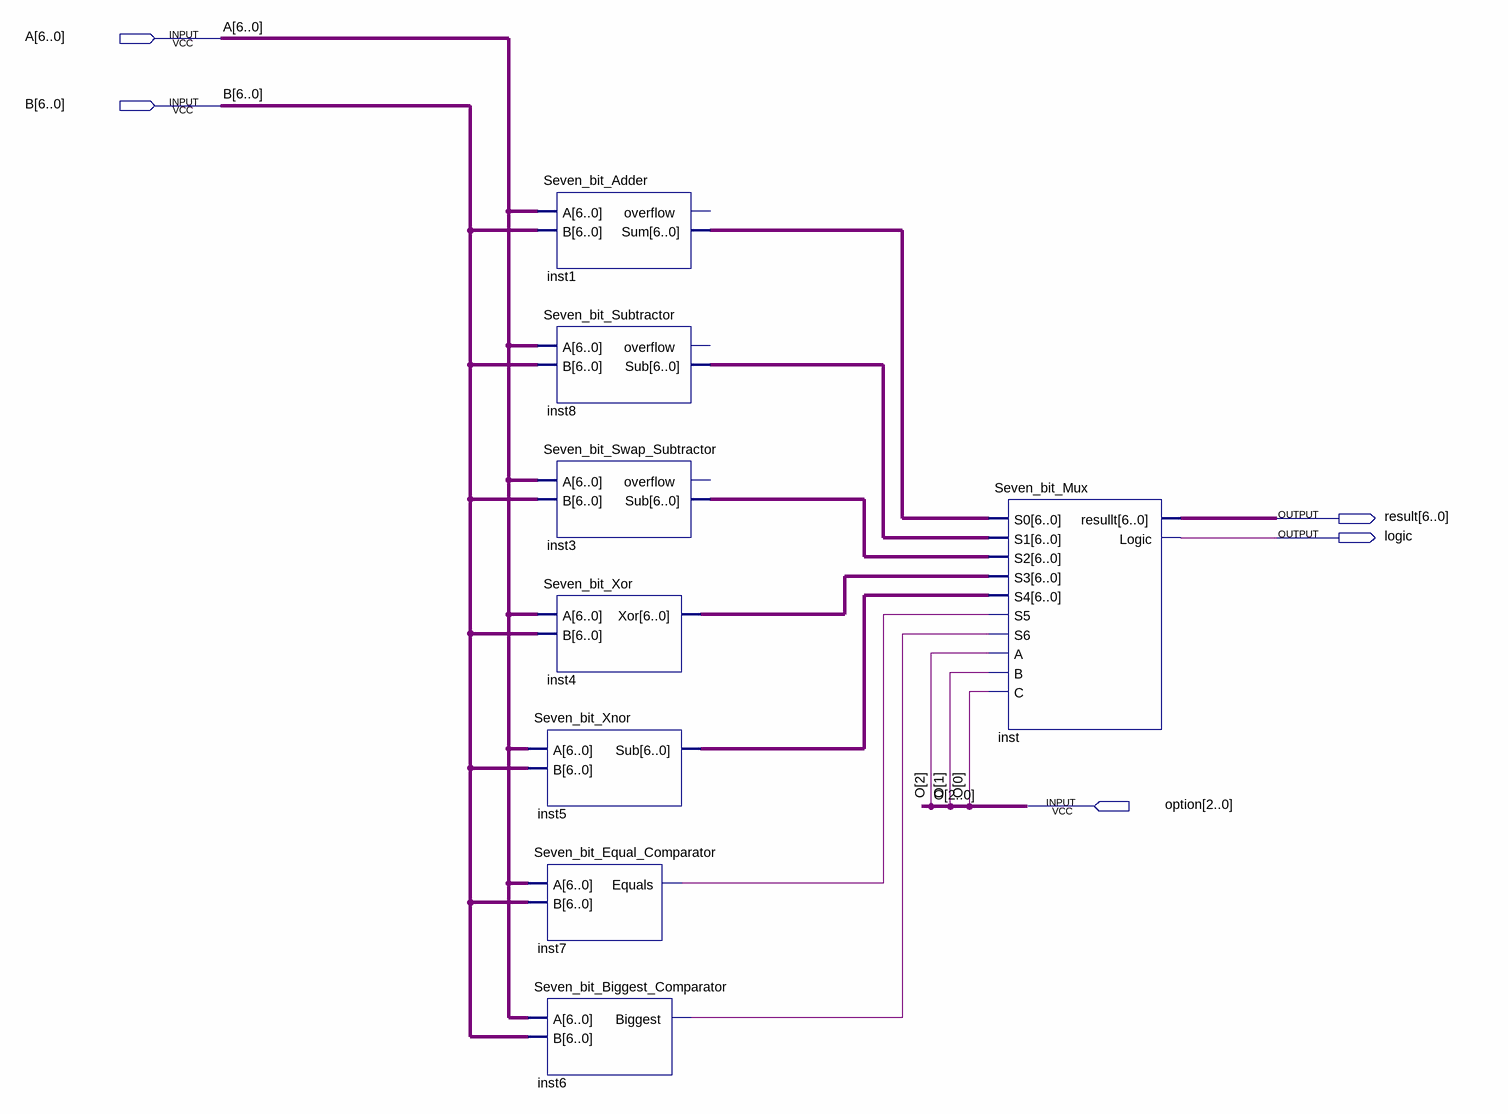
[diagram p0: schematic sheet]
// Quartus schematic ULA.bdf as structural Verilog: 8 symbols, 5 pins
module ULA (
  input  [6:0] A,
  input  [6:0] B,
  input  [2:0] option,
  output [6:0] result,
  output \logic 
);

  wire inst6_biggest, inst7_equals;
  wire [6:0] inst1_sum, inst3_sub, inst4_xor, inst5_sub, inst8_sub;

  Seven_bit_Adder inst1 (.A(A), .B(B), .Sum(inst1_sum));  // open: overflow
  Seven_bit_Subtractor inst8 (.A(A), .B(B), .Sub(inst8_sub));  // open: overflow
  Seven_bit_Swap_Subtractor inst3 (.A(A), .B(B), .Sub(inst3_sub));  // open: overflow
  Seven_bit_Xor inst4 (.A(A), .B(B), .Xor(inst4_xor));
  Seven_bit_Xnor inst5 (.A(A), .B(B), .Sub(inst5_sub));
  Seven_bit_Equal_Comparator inst7 (.A(A), .B(B), .Equals(inst7_equals));
  Seven_bit_Biggest_Comparator inst6 (.A(A), .B(B), .Biggest(inst6_biggest));
  Seven_bit_Mux inst (
    .S0(inst1_sum), .S1(inst8_sub), .S2(inst3_sub), .S3(inst4_xor), .S4(inst5_sub), .S5(inst7_equals),
    .S6(inst6_biggest), .A(option[2]), .B(option[1]), .C(option[0]), .resullt(result), .Logic(\logic ));

  // Other names for the same wires on the sheet: O[2:0] = option
endmodule
